# Altium schematic sheet Power Circuit.SchDoc
size A; SheetNumber: 5; SheetTotal: 6
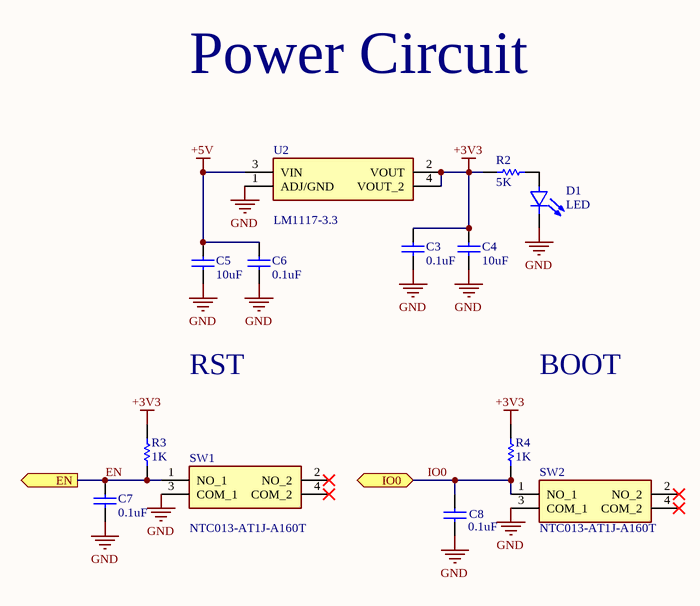
[diagram p0: Power Circuit.SchDoc]

## Parts
C3  0.1uF  [C0402]
C4  10uF  [C0402]
C5  10uF  [C0402]
C6  0.1uF  [C0402]
C7  0.1uF  [C0402]
C8  0.1uF  [C0402]
D1  LED  [LED0402]
R2  5K  [R0402]
R3  1K  [R0402]
R4  1K  [R0402]
SW1  NTC013-AT1J-A160T  [Tactile sw]
SW2  NTC013-AT1J-A160T  [Tactile sw]
U2  LM1117-3.3  [SOT223]

## Ports
EN (out, see Sheet1[4C], Connectors[1A], MCU Module[2B], MCU Module[2C]), IO0 (bidir, see Sheet1[4C], Connectors[4B], MCU Module[2B])

## Nets
+3V3: C3.02(-) C4.02(-) R2.02 R3.02 R4.02 U2.2(VOUT) U2.4(VOUT_2)
+5V: C5.02(-) C6.02(-) U2.3(VIN)
GND: C3.01(+) C4.01(+) C5.01(+) C6.01(+) C7.01(+) C8.01(+) D1.1(C) SW1.3(COM_1) SW2.3(COM_1) U2.1(ADJ/GND)
EN: C7.02(-) R3.01 SW1.1(NO_1) ; port EN
IO0: C8.02(-) R4.01 SW2.1(NO_1) ; port IO0
NetD1_2: D1.2(A) R2.01

Not connected (* = marked no-connect by the designer): SW1 2(NO_2)* 4(COM_2)*; SW2 2(NO_2)* 4(COM_2)*

## Notes on the sheet
- Power Circuit
- RST
- BOOT

## Library data of the parts
C3-C8 = Cap
R2-R4 = Res
U2 = LM1117-3.3: Linear Voltage Regulator IC Positive Fixed 1 Output 800mA DDPAK/TO-263-3